# Altium schematic sheet Shut Down Signal Control.SchDoc: Shut Down Signal Control
size 292 x 193 mm; SheetNumber: 7; SheetTotal: 15
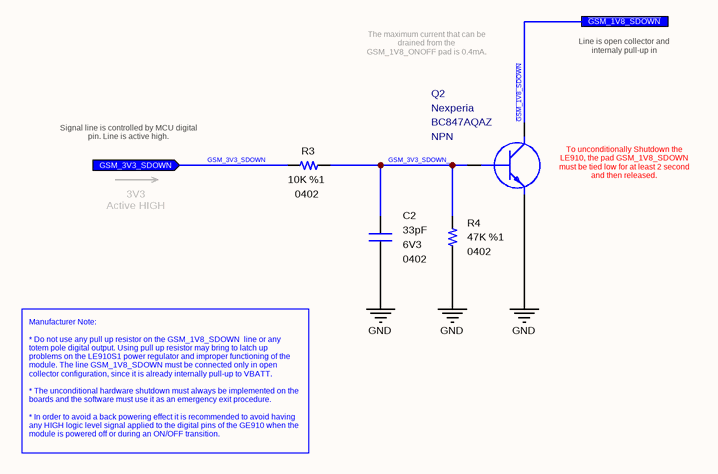
[diagram p0: Shut Down Signal Control.SchDoc]

## Parts
C2  value 33pF  Case: 0402  Voltage: 6V3  [CAPACITOR_0402]
Q2  Polarity: NPN  Manufacturer Part Number: BC847AQAZ  Manufacturer Name: Nexperia  [SOT1215]
R3  value 10K  Case: 0402  Tolerance: %1  [RESISTOR_0402]
R4  value 47K  Case: 0402  Tolerance: %1  [RESISTOR_0402]

## Ports
GSM_3V3_SDOWN (in), ~{GSM_1V8_SDOWN}

## Nets
GND: C2.1 Q2.2(E) R4.1
~{GSM_1V8_SDOWN}: Q2.3(C) ; port ~{GSM_1V8_SDOWN}
GSM_3V3_SDOWN: R3.2 ; port GSM_3V3_SDOWN
GSM_3V3_SDOWN_: C2.2 Q2.1(B) R3.1 R4.2

## Notes on the sheet
- The maximum current that can be drained from the GSM_1V8_ONOFF pad is 0.4mA.
- Line is open collector and internaly pull-up in LE910S1.
- Signal line is controlled by MCU digital pin. Line is active high.
- (near Q2) To unconditionally Shutdown the LE910, the pad GSM_1V8_SDOWN must be tied low for at least 2 second and then released.
- 3V3
  Active HIGH
- Manufacturer Note:
  * Do not use any pull up resistor on the GSM_1V8_SDOWN  line or any totem pole digital output. Using pull up resistor may bring to latch up problems on the LE910S1 power regulator and improper functioning of the module. The line GSM_1V8_SDOWN must be connected only in open collector configuration, since it is already internally pull-up to VBATT.
  * The unconditional hardware shutdown must always be implemented on the boards and the software must use it as an emergency exit procedure.
  * In order to avoid a back powering effect it is recommended to avoid having any HIGH logic level signal applied to the digital pins of the GE910 when the module is powered off or during an ON/OFF transition.
- © 2021 All rights reserved.
  This document may not, in whole or in part, be copied, photocopied, reproduced, translated or converted to any electronic or machine readable from without prior written permission of Mehmet Günce Akkoyun.
  Engineer contact : akkoyun@me.com
- Property of
- Engineer :
- Date :
- Size :
- A4
- Time :
- Project :
- Page :
- /
- Customer :
- Product ID :
- Module ID :
- Version :
- File :
- Revision :

## Library data of the parts
C2 = 33pF [0402-6V3]: Capacitor - 33pF [0402] (Ceramic); Manufacturer Part Number: C0402C330J9RACAUTO; Manufacturer Name: Kemet; Dielectric: X7R; Tolerance: 10%; Height: 0.5mm; Maximum Operating Temperature: +125; Minimum Operating Temperature: -55; ROHS: Yes; ComponentLink1Description: DataSheet; ComponentLink1URL: https://api.kemet.com/component-edge/download/datasheet/C0402C330J9RACAUTO.pdf; ComponentLink2Description: Mouser; ComponentLink2URL: https://www.mouser.com/Search/Refine.aspx?Keyword=80-C0402C330J9RAUTO
Q2 = BC847: Bipolar NPN Transistors; Case: DFN-1010D-3
R3 = 10K: Thick Film Resistors - SMD 1/16 W 10 Kohms 1%; Manufacturer Name: Vishay; Manufacturer Part Number: CRCW040210K0FKED; Height: 0.4mm; ComponentLink1Description: DataSheet; ComponentLink1URL: https://www.mouser.com.tr/datasheet/2/427/dcrcwe3-1762152.pdf; ComponentLink2Description: Mouser; ComponentLink2URL: https://www.mouser.com.tr/ProductDetail/Vishay-Dale/CRCW040210K0FKED?qs=sGAEpiMZZMu61qfTUdNhG2DpbjADlD3GcalbOv9utCY%3D
R4 = 47K: Thick Film Resistors - SMD 1/16 W 47 Kohms 1%; Manufacturer Name: Vishay; Manufacturer Part Number: CRCW040247K0FKED; ComponentLink1URL: https://www.mouser.com.tr/datasheet/2/427/dcrcwe3-1762152.pdf; ComponentLink1Description: DataSheet; Height: 0.4mm; ComponentLink2Description: Mouser; ComponentLink2URL: https://www.mouser.com.tr/ProductDetail/Vishay-Dale/CRCW040247K0FKED?qs=sGAEpiMZZMu61qfTUdNhG2DpbjADlD3GL%252B3h1elTxqU%3D